# EAGLE design avrisp mk2c (EAGLE 5.10)
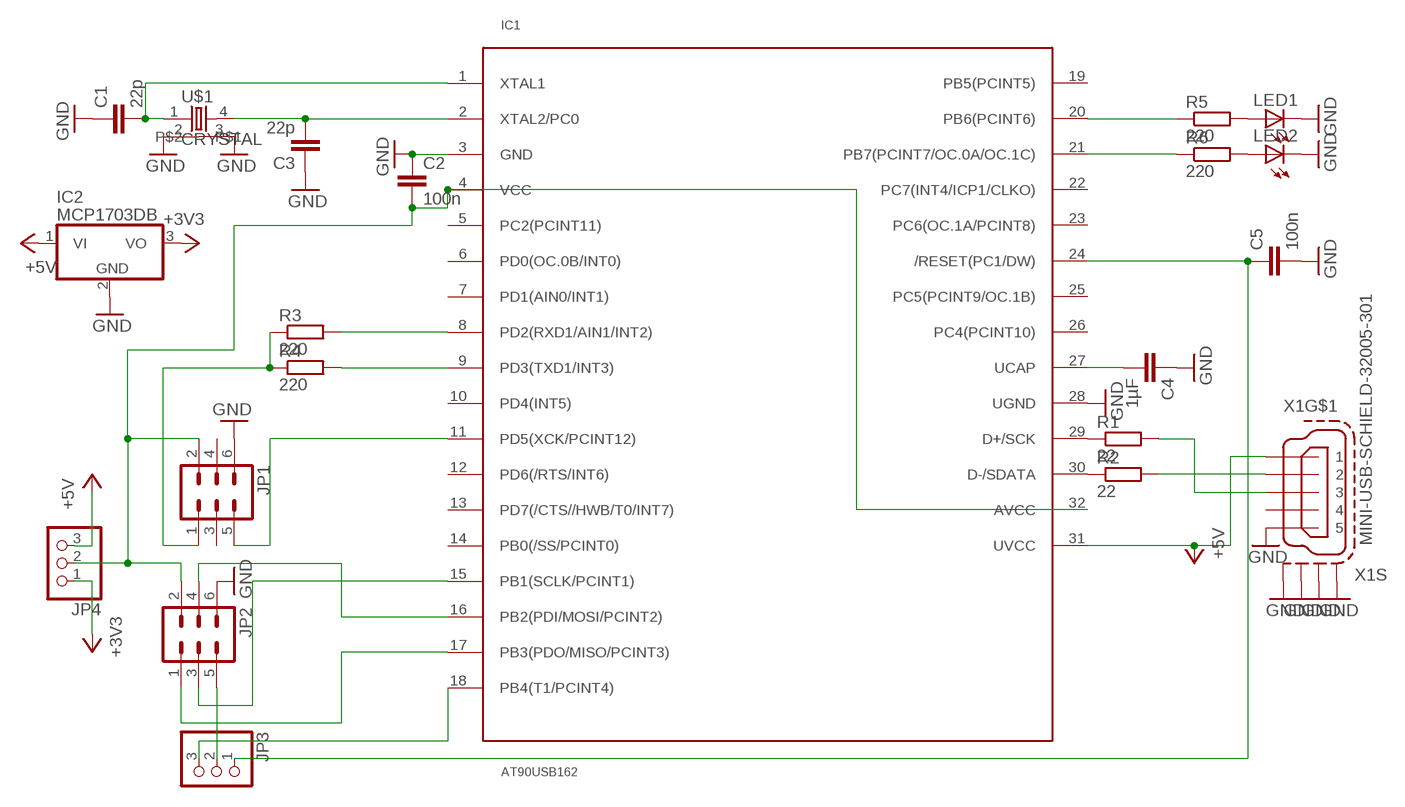
[diagram p0: schematic, sheet 1]

## Parts
C1  22p  C-EUC0805  [C0805]
C2  100n  C-EUC0805  [C0805]
C3  22p  C-EUC0805  [C0805]
C4  1µF  C-EUC0805  [C0805]
C5  100n  C-EUC0805  [C0805]
IC1  AT90USB162  [TQFP32-08]
IC2  MCP1703DB  [SOT223]
JP1  ML6  [ML6]
JP2  ML6  [ML6]
JP3  PINHD-1X3  [1X03]
JP4  PINHD-1X3  [1X03]
LED1  LEDCHIPLED_0805  [CHIPLED_0805]
LED2  LEDCHIPLED_0805  [CHIPLED_0805]
R1  22  R-EU_R0805  [R0805]
R2  22  R-EU_R0805  [R0805]
R3  220  R-EU_R0805  [R0805]
R4  220  R-EU_R0805  [R0805]
R5  220  R-EU_R0805  [R0805]
R6  220  R-EU_R0805  [R0805]
U$1  CRYSTAL  [MT]
X1  MINI-USB-SCHIELD-32005-301  [32005-301]

## Nets
+3V3: IC2.3(VO) JP4.1
+5V: IC1.31(UVCC) IC2.1(VI) JP4.3 X1.1
GND: C1.1 C2.1 C3.1 C4.1 C5.2 IC1.3(GND) IC1.28(UGND) IC2.2(GND) JP1.6 JP2.6 LED1.C LED2.C U$1.2 U$1.3 X1.5 X1.M1(S:S1) X1.M2(S:S2) X1.M3(S:S3) X1.M4(S:S4)
N$1: C4.2 IC1.27(UCAP)
N$2: C1.2 IC1.1(XTAL1) U$1.1
N$3: C3.2 IC1.2(XTAL2/PC0) U$1.4
N$4: C2.2 IC1.4(VCC) IC1.32(AVCC) JP1.2 JP2.2 JP4.2
N$5: IC1.29(D+/SCK) R1.1
N$6: IC1.30(D-/SDATA) R2.1
N$7: R1.2 X1.3
N$8: R2.2 X1.2
N$9: IC1.11(PD5(XCK/PCINT12)) JP1.5
N$10: JP1.1 R3.1 R4.1
N$11: IC1.8(PD2(RXD1/AIN1/INT2)) R3.2
N$12: IC1.9(PD3(TXD1/INT3)) R4.2
N$13: C5.1 IC1.24(/RESET(PC1/DW)) JP3.1
N$14: IC1.17(PB3(PDO/MISO/PCINT3)) JP2.1
N$15: IC1.15(PB1(SCLK/PCINT1)) JP2.3
N$16: IC1.16(PB2(PDI/MOSI/PCINT2)) JP2.4
N$17: IC1.18(PB4(T1/PCINT4)) JP3.3
N$19: LED1.A R5.2
N$20: LED2.A R6.2
N$21: IC1.20(PB6(PCINT6)) R5.1
N$22: IC1.21(PB7(PCINT7/OC.0A/OC.1C)) R6.1
N$23: JP2.5 JP3.2
Unconnected: IC1.5(PC2(PCINT11)) IC1.6(PD0(OC.0B/INT0)) IC1.7(PD1(AIN0/INT1)) IC1.10(PD4(INT5)) IC1.12(PD6(/RTS/INT6)) IC1.13(PD7(/CTS//HWB/T0/INT7)) IC1.14(PB0(/SS/PCINT0)) IC1.19(PB5(PCINT5)) IC1.22(PC7(INT4/ICP1/CLKO)) IC1.23(PC6(OC.1A/PCINT8)) IC1.25(PC5(PCINT9/OC.1B)) IC1.26(PC4(PCINT10)) JP1.3 JP1.4 X1.4

## Library data of the parts
C1-C5 = rcl:C-EU: CAPACITOR, European symbol
IC1 = Labor:AT90USB162: AT90USB162
IC2 = linear:MCP1703: 250 mA, 16V, Low Quiescent Current LDO Regulator Source: http://ww1.microchip.com/downloads/en/DeviceDoc/22049b.pdf
JP1 JP2 = con-ml:ML6: HARTING
JP3 JP4 = pinhead:PINHD-1X3: PIN HEADER
LED1 LED2 = led:LED: LED OSRAM: - CHIPLED LG R971, LG N971, LY N971, LG Q971, LY Q971, LO R971, LY R971 LH N974, LH R974 LS Q976, LO Q976, LY Q976 LO Q996 - Hyper CHIPLED LW Q18S LB Q993, LB Q99A, LB R99A - SideLED LS A670, LO A670, LY A670, LG A670, LP A670 LB A673, LV A673, LT A673, LW A673 LH A674 LY A675 LS A676, LA A676, LO A676, LY A676, LW A676 LS A679, LY A679, LG A679 - Hyper Micro SIDELED® LS Y876, LA Y876, LO Y876, LY Y876 LT Y87S - SmartLED LW L88C, LW L88S LB L89C, LB L89S, LG L890 LS L89K, LO L89K, LY L89K LS L896, LA L896, LO L896, LY L896 - TOPLED LS T670, LO T670, LY T670, LG T670, LP T670 LSG T670, LSP T670, LSY T670, LOP T670, LYG T670 LG T671, LOG T671, LSG T671 LB T673, LV T673, LT T673, LW T673 LH T674 LS T676, LA T676, LO T676, LY T676, LB T676, LH T676, LSB T676, LW T676 LB T67C, LV T67C, LT T67C, LS T67K, LO T67K, LY T67K, LW E67C LS E67B, LA E67B, LO E67B, LY E67B, LB E67C, LV E67C, LT E67C LW T67C LS T679, LY T679, LG T679 LS T770, LO T770, LY T770, LG T770, LP T770 LB T773, LV T773, LT T773, LW T773 LH T774 LS E675, LA E675, LY E675, LS T675 LS T776, LA T776, LO T776, LY T776, LB T776 LHGB T686 LT T68C, LB T68C - Hyper Mini TOPLED® LB M676 - Mini TOPLED Santana® LG M470 LS M47K, LO M47K, LY M47K Source: http://www.osram.convergy.de LUXEON: - LUMILED® LXK2-PW12-R00, LXK2-PW12-S00, LXK2-PW14-U00, LXK2-PW14-V00 LXK2-PM12-R00, LXK2-PM12-S00, LXK2-PM14-U00 LXK2-PE12-Q00, LXK2-PE12-R00, LXK2-PE12-S00, LXK2-PE14-T00, LXK2-PE14-U00 LXK2-PB12-K00, LXK2-PB12-L00, LXK2-PB12-M00, LXK2-PB14-N00, LXK2-PB14-P00, LXK2-PB14-Q00 LXK2-PR12-L00, LXK2-PR12-M00, LXK2-PR14-Q00, LXK2-PR14-R00 LXK2-PD12-Q00, LXK2-PD12-R00, LXK2-PD12-S00 LXK2-PH12-R00, LXK2-PH12-S00 LXK2-PL12-P00, LXK2-PL12-Q00, LXK2-PL12-R00 Source: www.luxeon.com KINGBRIGHT: KA-3528ASYC Source: www.kingbright.com
R1-R6 = rcl:R-EU_: RESISTOR, European symbol
U$1 = Labor:CRYSTAL: SMD Crystal FEATURES Frequency range 12MHz to 60MHz, fundamental mode Ultra-small package 3.2mm x 2.5mm x 0.6mm Packaged in standard EIA tape and reel Ideal for PDAs, hand-held GPS, PCMCIA etc. MT crystals are ultra-miniature AT-cut crystals covering the frequency range 12MHz to 60MHz in fundamental mode and up to 150MHz in 3rd overtone mode. Their small size and low mass makes these crystals ideal for miniaturized hand-held equipment and similar high-density applications.
X1 = con-cypressindustries:MINI-USB-SCHIELD-: MINI USB-B Conector Source: www.cypressindustries.com

## Board
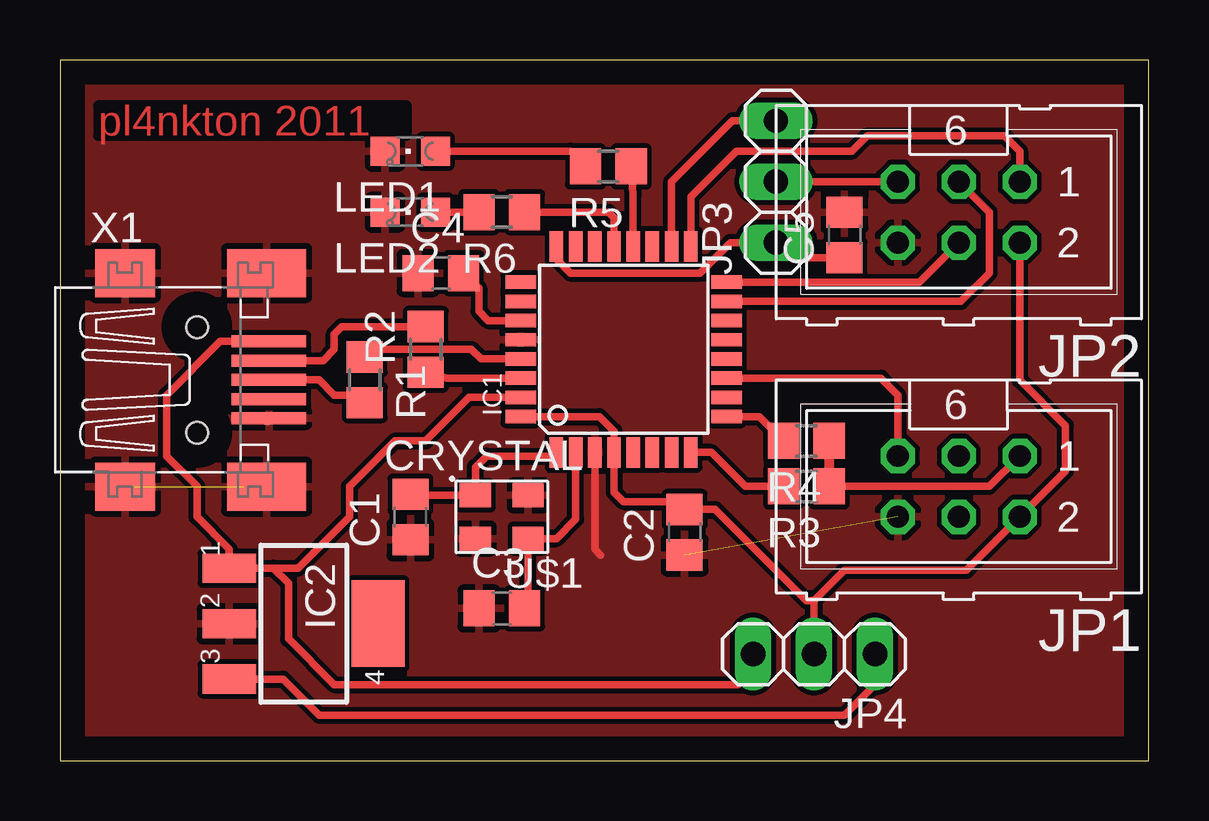
[diagram p1: board, top side]

Size 45.39 x 29.2 mm. Coordinates in mm from the lower left corner, seen from the top.
Outline: 0,0 45.39,0 45.39,29.2 0,29.2 0,0
Copper layers (1*16): Top 0.035mm / dielectric 1.5mm / Bottom 0.035mm
Design rules "default": minimum track width 10mil, minimum drill 24mil, track to track 8mil, track to pad 8mil, pad to pad 8mil, via to via 8mil, smd to smd 8mil, copper to edge 40mil, drill to drill 8mil, minimum pad ring 10mil, minimum via ring 8mil, stop-mask expansion 4mil, vias tented up to drill 0mil, thermal gap 10mil

### Footprints (pad centres in the part's own frame; a part is rotated, then mirrored left to right if it is on the bottom)
C0805 = smd 1.3 x 1.5: 1 -0.95,0; 2 0.95,0
TQFP32-08 = smd 1.27 x 0.559: 1 -4.293,2.8; 2 -4.293,2; 3 -4.293,1.2; 4 -4.293,0.4; 5 -4.293,-0.4; 6 -4.293,-1.2; 7 -4.293,-2; 8 -4.293,-2.8; 17 4.293,-2.8; 18 4.293,-2; 19 4.293,-1.2; 20 4.293,-0.4; 21 4.293,0.4; 22 4.293,1.2; 23 4.293,2; 24 4.293,2.8 | smd 0.559 x 1.27: 9 -2.8,-4.293; 10 -2,-4.293; 11 -1.2,-4.293; 12 -0.4,-4.293; 13 0.4,-4.293; 14 1.2,-4.293; 15 2,-4.293; 16 2.8,-4.293; 25 2.8,4.293; 26 2,4.293; 27 1.2,4.293; 28 0.4,4.293; 29 -0.4,4.293; 30 -1.2,4.293; 31 -2,4.293; 32 -2.8,4.293
SOT223 = smd 1.219 x 2.235: 1 -2.311,-3.099; 2 0,-3.099; 3 2.311,-3.099 | smd 3.6 x 2.2: 4 0,3.099
ML6 = drill 0.914 octagon: 1 -2.54,-1.27; 2 -2.54,1.27; 3 0,-1.27; 4 0,1.27; 5 2.54,-1.27; 6 2.54,1.27
1X03 = drill 1.016 long: 1 -2.54,0; 2 0,0; 3 2.54,0
CHIPLED_0805 = smd 1.2 x 1.2: A 0,-1.05; C 0,1.05
R0805 = smd 1.3 x 1.5: 1 -0.95,0; 2 0.95,0
MT = smd 1.3 x 1: 1 1.1,-0.9; 2 -1.1,-0.9; 3 1.1,0.9; 4 -1.1,0.9
32005-301 = smd 3.1 x 0.5: 1 3,1.6; 2 3,0.8; 3 3,0; 4 3,-0.8; 5 3,-1.6 | smd 2.5 x 2: M1 -3,-4.45; M2 -3,4.45 | smd 3.3 x 2: M3 2.9,4.45; M4 2.9,-4.45 | hole 0.9: 0,2.2; 0,-2.2

### Placement (x,y rotation side)
C1  14.61,10.16 90 top
C2  26.04,9.53 90 top
C3  18.41,6.35 0 top
C4  15.88,20.32 0 top
C5  32.7,21.91 90 top
IC1  23.5,17.14 90 top
IC2  10.16,5.71 270 top
JP1  37.47,11.43 180 top
JP2  37.47,22.86 180 top
JP3  29.84,24.13 90 top
JP4  31.43,4.45 180 top
LED1  14.61,25.4 90 top
LED2  14.61,22.86 90 top
R1  12.7,15.88 270 top
R2  15.24,17.14 90 top
R3  31.11,11.43 180 top
R4  31.11,13.34 180 top
R5  22.86,24.77 180 top
R6  18.41,22.86 180 top
U$1  18.41,10.16 180 top
X1  5.71,15.88 0 top

### Tracks (layer width: path | path; a pad name or v marks a point on that pad's centre or on a via)
+3V3
  Top 0.305: IC2.3 9.3,3.4 10.79,1.91 32.7,1.91 33.97,3.17 JP4.1
+5V
  Top 0.305: 8.89,8.03 IC2.1 7.06,8.81 5.71,10.16 5.71,11.43 4.45,12.7 4.45,15.24 6.68,17.48 X1.1 | 8.89,8.03 9.93,8.03 12.06,10.16 12.06,11.43 13.97,13.34 15.24,13.34 17.05,15.14 IC1.31 | 8.89,8.03 9.53,7.39 9.53,5.08 11.43,3.17 28.26,3.17 28.89,3.81 JP4.3
GND  (2 unrouted)
  Top 0.305: IC1.3 22.3,8.82 22.54,8.57
  Top 0.406: X1.M4 7.62,11.43 | X1.5 8.62,14.18 | 2.54,20.32 | X1.M1 2.54,11.6
  pour Top: -1.59,31.11 46.99,31.11 46.99,-1.91 -1.59,-1.91
N$1
  Top 0.305: IC1.27 17.85,18.34 17.46,18.73 17.46,19.68 C4.2
N$2
  Top 0.305: 15.29,11.06 C1.2 14.61,11.06 U$1.1 17.32,12.23 17.78,12.7 20.54,12.7 IC1.1
N$3
  Top 0.305: C3.2 19.52,7.13 U$1.4 20.69,9.26 21.5,10.06 IC1.2
N$4
  Top 0.305: JP2.2 40.01,15.88 41.91,13.97 41.91,12.06 JP1.2 37.78,7.94 32.7,7.94 31.43,6.67 | 31.43,6.67 JP4.2 | 31.43,6.67 31.11,6.67 27.3,10.48 26.67,10.48 | 26.67,10.48 C2.2 | 26.67,10.48 26.35,10.79 23.5,10.79 23.09,11.2 IC1.4 23.09,13.73 22.48,14.35 IC1.32
N$5
  Top 0.305: IC1.29 17.55,16.75 17.14,17.14 13.02,17.14 R1.1
N$6
  Top 0.305: IC1.30 16.12,15.95 R2.1
N$7
  Top 0.305: X1.3 10.79,15.88 11.43,15.24 12.38,15.24 R1.2
N$8
  Top 0.305: R2.2 11.74,18.09 11.43,17.78 11.43,17.14 10.96,16.68 X1.2
N$9
  Top 0.305: JP1.5 34.92,15.24 34.22,15.95 IC1.11
N$10
  Top 0.305: JP1.1 38.73,11.43 R3.1
  Top 0.406: R3.1 R4.1
N$11
  Top 0.305: IC1.8 27.15,12.85 28.57,11.43 R3.2
N$12
  Top 0.305: R4.2 29.16,14.35 IC1.9
N$13
  Top 0.305: IC1.24 20.7,20.9 21.27,20.32 26.67,20.32 27.94,21.59 JP3.1 30.48,20.96 C5.1
N$14
  Top 0.305: IC1.17 26.3,23.5 28.2,25.4 33.02,25.4 33.66,26.04 39.37,26.04 40.01,25.4 JP2.1
N$15
  Top 0.305: IC1.15 37.56,19.14 38.73,20.32 38.73,22.86 JP2.3
N$16
  Top 0.305: JP2.4 35.82,19.95 IC1.16
N$17
  Top 0.305: IC1.18 25.5,24.13 28.04,26.67 JP3.3
N$19
  Top 0.305: R5.2 21.27,25.4 LED1.A
N$20
  Top 0.305: R6.2 LED2.A
N$21
  Top 0.305: IC1.20 23.89,23.58 R5.1
N$22
  Top 0.305: IC1.21 23.09,22.62 22.86,22.86 R6.1
N$23
  Top 0.305: JP3.2 JP2.5

### Text on the board
Top: pl4nkton 2011